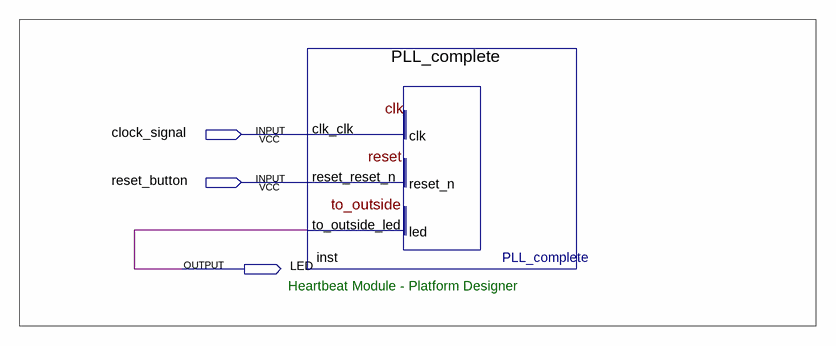
[diagram p0: schematic sheet]
// Quartus schematic PLL_Platform_Desginer.bdf as structural Verilog: 1 symbols, 3 pins
module PLL_Platform_Desginer (
  input  clock_signal,
  input  reset_button,
  output LED
);

  PLL_complete inst (.clk_clk(clock_signal), .reset_reset_n(reset_button), .to_outside_led(LED));

  // Notes on the sheet:
  //   Heartbeat Module - Platform Designer
endmodule
